# Altium project CAN2USB.PrjPcb
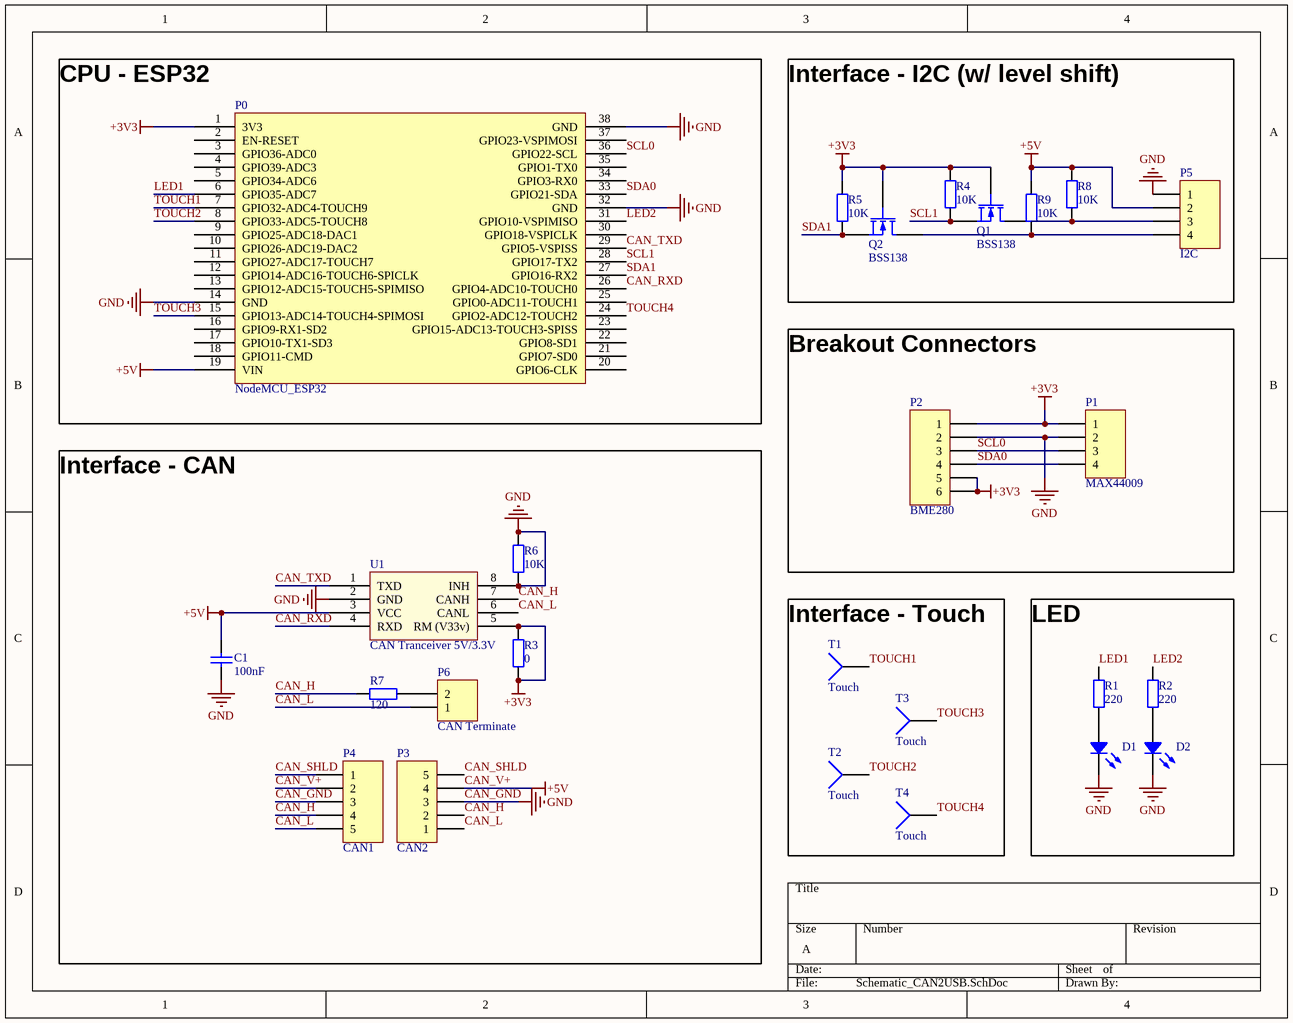
[diagram p0: Schematic_CAN2USB.SchDoc]
1 sheet, 26 parts. Net scope: global (net labels, ports and power ports of the same name join across sheets).
Board file: PCB_CAN2USB.PcbDoc

## Sheet Schematic_CAN2USB.SchDoc
size A

### Parts
C1  value 100nF  [CAP 0805/2012]  (hidden comment: Cap)
D1  Green  [LED 0805/2012 RED]  (value not drawn)
D2  Green  [LED 0805/2012 RED]  (value not drawn)
P0  NodeMCU_ESP32  [NodeMCU]
P1  MAX44009  [MAX44009_Breakout]
P2  BME280  [BME280_Breakout]
P3  CAN2  [TE 282834-5]
P4  CAN1  [TE 282834-5]
P5  I2C  [TE 282834-4]
P6  CAN Terminate  [SAMTEC SSW-102-03-T-S]
Q1  BSS138  [DIODES SOT-23-3]
Q2  BSS138  [DIODES SOT-23-3]
R1  value 220  [RES 0805/2012]  (hidden comment: Res2)
R2  value 220  [RES 0805/2012]  (hidden comment: Res2)
R3  value 0  [RES 0805/2012]  (hidden comment: Res2)
R4  value 10K  [RES 0805/2012]  (hidden comment: Res2)
R5  value 10K  [RES 0805/2012]  (hidden comment: Res2)
R6  value 10K  [RES 0805/2012]  (hidden comment: Res2)
R7  value 120  [RES 0805/2012]  (hidden comment: Res2)
R8  value 10K  [RES 0805/2012]  (hidden comment: Res2)
R9  value 10K  [RES 0805/2012]  (hidden comment: Res2)
T1  Touch  [Pad]
T2  Touch  [Pad]
T3  Touch  [Pad]
T4  Touch  [Pad]
U1  CAN Tranceiver 5V/3.3V  [MICROCHIP SOIC-8 150mil Wide]

### Nets
+3V3: P0.1(3V3) P1.1 P2.1 P2.5 P2.6 Q1.2(G) Q2.2(G) R3.1 R3.2 R4.2 R5.2 U1.5(RM_(V33v))
CAN_GND: C1.2 D1.2 D2.2 P0.14(GND) P0.32(GND) P0.38(GND) P1.2 P2.2 P3.3 P4.3 P5.1 R6.1 R6.2 U1.2(GND) U1.8(INH)  [also labelled GND]
CAN_V+: C1.1 P0.19(VIN) P3.4 P4.2 P5.2 R8.2 R9.2 U1.3(VCC)  [also labelled +5V]
CAN_H: P3.2 P4.4 R7.2 U1.7(CANH)
CAN_L: P3.1 P4.5 P6.1 U1.6(CANL)
CAN_RXD: P0.26(GPIO4-ADC10-TOUCH0) U1.4(RXD)
CAN_SHLD: P3.5 P4.1
CAN_TXD: P0.29(GPIO5-VSPISS) U1.1(TXD)
LED1: P0.6(GPIO35-ADC7) R1.2
LED2: P0.31(GPIO10-VSPIMISO) R2.2
SCL0: P0.36(GPIO22-SCL) P1.3 P2.3
SCL1: P0.28(GPIO17-TX2) Q1.3(S) R4.1
SDA0: P0.33(GPIO21-SDA) P1.4 P2.4
SDA1: P0.27(GPIO16-RX2) Q2.3(S) R5.1
TOUCH1: P0.7(GPIO32-ADC4-TOUCH9) T1.1
TOUCH2: P0.8(GPIO33-ADC5-TOUCH8) T2.1
TOUCH3: P0.15(GPIO13-ADC14-TOUCH4-SPIMOSI) T3.1
TOUCH4: P0.24(GPIO2-ADC12-TOUCH2) T4.1
NetD1_1: D1.1 R1.1
NetD2_1: D2.1 R2.1
NetP5_3: P5.3 Q1.1(D) R8.1
NetP5_4: P5.4 Q2.1(D) R9.1
NetP6_2: P6.2 R7.1

Not connected (* = marked no-connect by the designer): P0 2(EN-RESET) 3(GPIO36-ADC0) 4(GPIO39-ADC3) 5(GPIO34-ADC6) 9(GPIO25-ADC18-DAC1) 10(GPIO26-ADC19-DAC2) 11(GPIO27-ADC17-TOUCH7) 12(GPIO14-ADC16-TOUCH6-SPICLK) 13(GPIO12-ADC15-TOUCH5-SPIMISO) 16(GPIO9-RX1-SD2) 17(GPIO10-TX1-SD3) 18(GPIO11-CMD) 20(GPIO6-CLK) 21(GPIO7-SD0) 22(GPIO8-SD1) 23(GPIO15-ADC13-TOUCH3-SPISS) 25(GPIO0-ADC11-TOUCH1) 30(GPIO18-VSPICLK) 34(GPIO3-RX0) 35(GPIO1-TX0) 37(GPIO23-VSPIMOSI)

### Notes on the sheet
- Interface - I2C (w/ level shift)
- (near P0) CPU - ESP32
- Breakout Connectors
- Interface - Touch
- LED
- Interface - CAN

### Library data of the parts
C1 = Cap: Capacitor; Published: 8-Jun-2000; LatestRevisionDate: 17-Jul-2002; LatestRevisionNote: Re-released for DXP Platform.; PackageReference: RAD-0.3; Publisher: Altium Limited; PackageDescription: Radial Cap, Thru-Hole; 2 Leads; 0.3 in Pin Spacing
D1 D2 = LED: Chip LED; Value: Green
P1 P5 = Header 4: Header, 4-Pin; LatestRevisionDate: 17-Jul-2002; LatestRevisionNote: Re-released for DXP Platform.; Publisher: Altium Limited
P2 = Header 6: Header, 6-Pin; LatestRevisionDate: 17-Jul-2002; LatestRevisionNote: Re-released for DXP Platform.; Publisher: Altium Limited
P3 P4 = Header 5: Header, 5-Pin; LatestRevisionDate: 17-Jul-2002; LatestRevisionNote: Re-released for DXP Platform.; Publisher: Altium Limited
P6 = Header 2: Header, 2-Pin; LatestRevisionDate: 17-Jul-2002; LatestRevisionNote: Re-released for DXP Platform.; Publisher: Altium Limited
Q1 Q2 = MOSFET-N: N-Channel MOSFET; pin to pad: 1>3 2>1 3>2; Published: 8-Jun-2000; LatestRevisionDate: 17-Jul-2002; LatestRevisionNote: Re-released for DXP Platform.; PackageVersion: 1995/1996; PackageReference: E3; Publisher: Altium Limited; PackageDescription: TO, Flat Index; 3 In-Line, Axial Leads; Body Dia. 4.6mm; Lead Dia. 0.5 mm (max)
R1-R9 = Res2: Resistor; Published: 8-Jun-2000; LatestRevisionDate: 17-Jul-2002; LatestRevisionNote: Re-released for DXP Platform.; PackageReference: AXIAL-0.4; Publisher: Altium Limited; PackageDescription: Axial Device, Thru-Hole; 2 Leads; 0.4 in Pin Spacing
T1-T4 = Socket: LatestRevisionDate: 17-Jul-2002; LatestRevisionNote: Re-released for DXP Platform.; Publisher: Altium Limited
U1 = TLE6250G(V33)